# EAGLE design cm_ltc6102 (EAGLE 8.3.0)

## Sheet 1 of 2
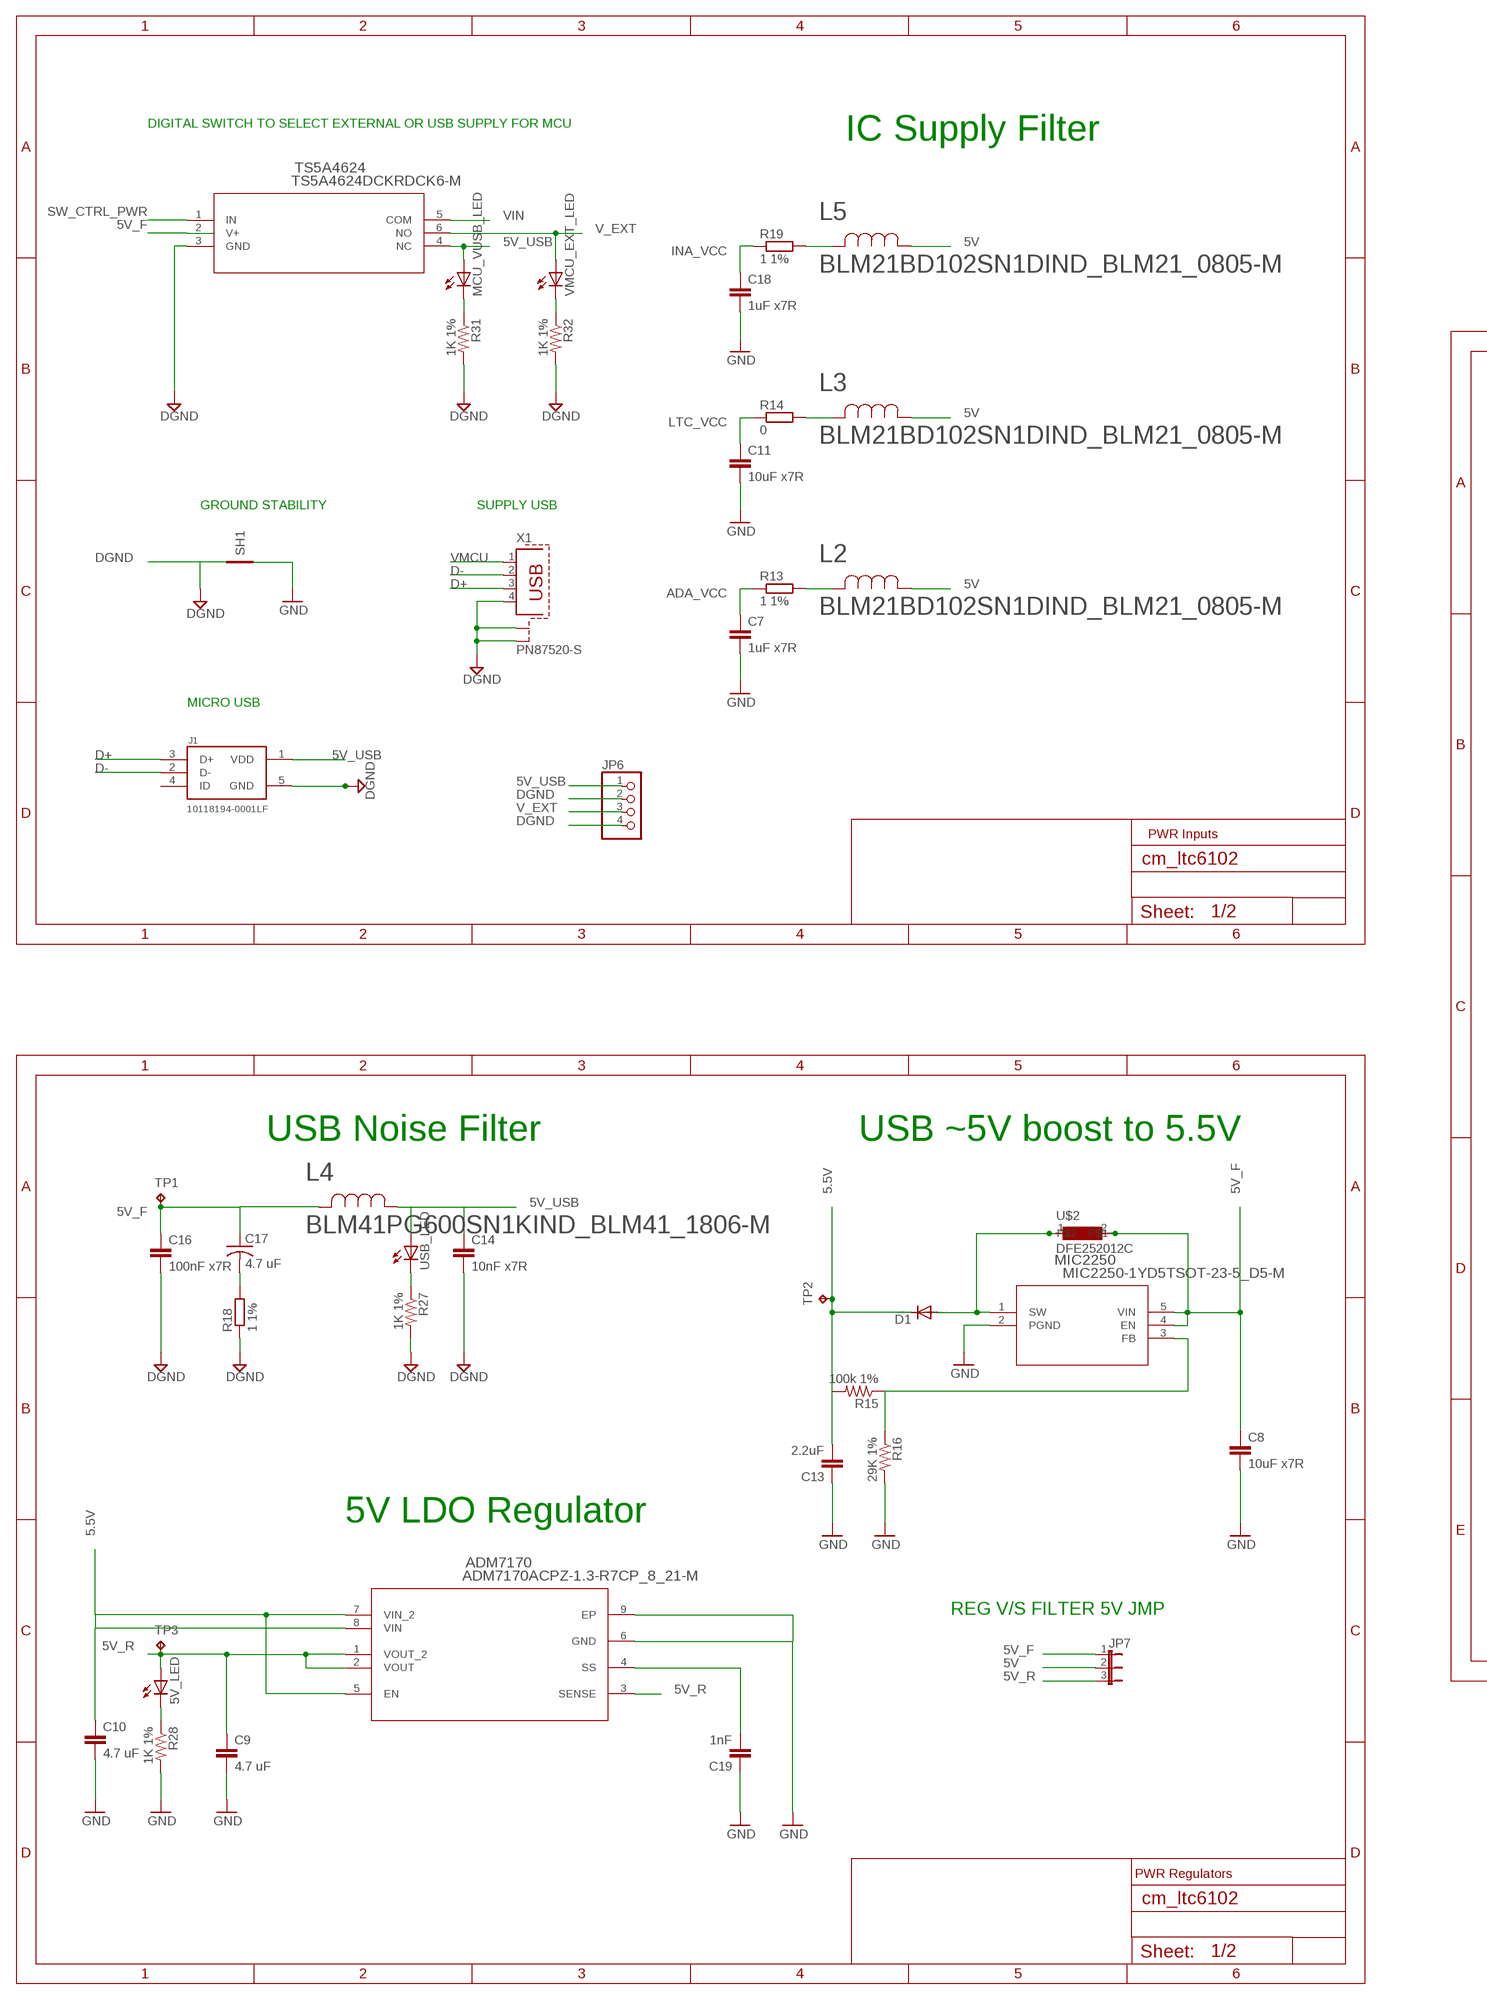
[diagram p0: schematic, sheet 1, part 1 of 2]
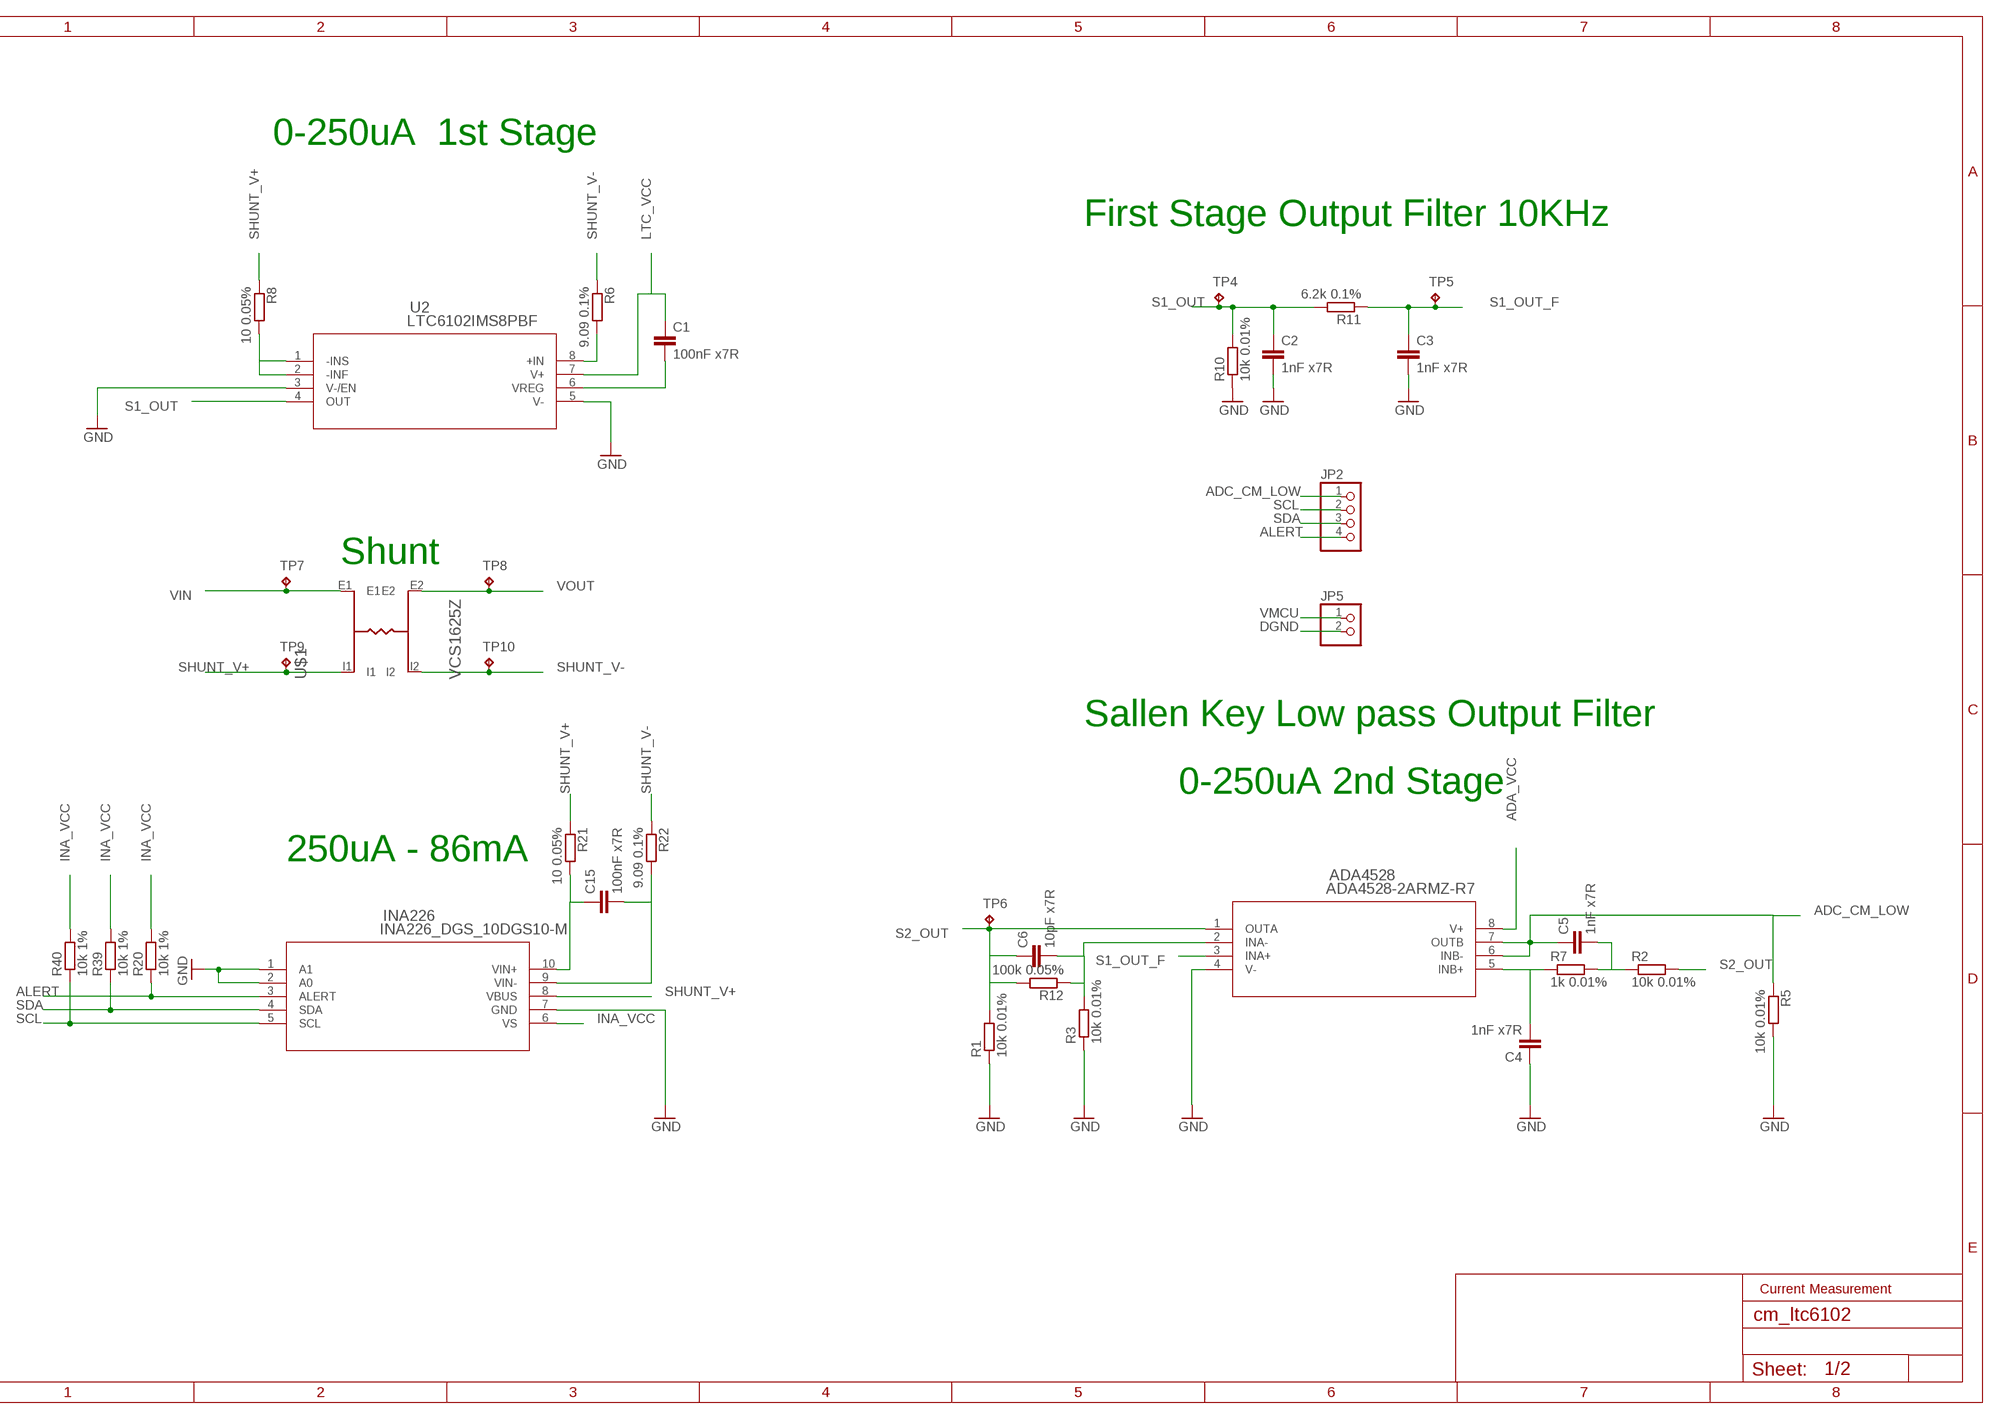
[diagram p1: schematic, sheet 1, part 2 of 2]

### Parts
5V_LED  LEDCHIPLED_0603  [CHIPLED_0603]
ADA4528  ADA4528-2ARMZ-R7  [RM_8]
ADM7170  ADM7170ACPZ-1.3-R7CP_8_21-M  [CP_8_21-M]
C1  100nF x7R  C-EUC0603  [C0603]
C2  1nF x7R  C-EUC0603  [C0603]
C3  1nF x7R  C-EUC0603  [C0603]
C4  1nF x7R  C-EUC0603  [C0603]
C5  1nF x7R  C-EUC0603  [C0603]
C6  10pF x7R  C-EUC0603  [C0603]
C7  1uF x7R  C-EUC0603  [C0603]
C8  10uF x7R  C-EUC0805  [C0805]
C9  4.7 uF  C-EUC1206  [C1206]
C10  4.7 uF  C-EUC1206  [C1206]
C11  10uF x7R  C-EUC0805  [C0805]
C13  2.2uF  C-EUC0603  [C0603]
C14  10nF x7R  C-EUC0603  [C0603]
C15  100nF x7R  C-EUC0603  [C0603]
C16  100nF x7R  C-EUC0603  [C0603]
C17  4.7 uF  C-USC1206  [C1206]
C18  1uF x7R  C-EUC0603  [C0603]
C19  1nF  C-EUC0603  [C0603]
D1  DIODE-SOD80C  [SOD80C]
INA226  INA226_DGS_10DGS10-M  [DGS10-M]
J1  10118194-0001LF  [FRAMATOME_10118194-0001LF]
JP2  PINHD-1X4  [1X04]
JP5  PINHD-1X2  [1X02]
JP6  PINHD-1X4  [1X04]
JP7  JP2E  [JP2]
L2  BLM21BD102SN1DIND_BLM21_0805-M  [IND_BLM21_0805-M]
L3  BLM21BD102SN1DIND_BLM21_0805-M  [IND_BLM21_0805-M]
L4  BLM41PG600SN1KIND_BLM41_1806-M  [IND_BLM41_1806-M]
L5  BLM21BD102SN1DIND_BLM21_0805-M  [IND_BLM21_0805-M]
MCU_VUSB_LED  LEDCHIPLED_0603  [CHIPLED_0603]
MIC2250  MIC2250-1YD5TSOT-23-5_D5-M  [TSOT-23-5_D5-M]
R1  10k 0.01%  R-EU_R0603  [R0603]
R2  10k 0.01%  R-EU_R0603  [R0603]
R3  10k 0.01%  R-EU_R0603  [R0603]
R5  10k 0.01%  R-EU_R0603  [R0603]
R6  9.09 0.1%  R-EU_R0603  [R0603]
R7  1k 0.01%  R-EU_R0805  [R0805]
R8  10 0.05%  R-EU_R0603  [R0603]
R10  10k 0.01%  R-EU_R0603  [R0603]
R11  6.2k 0.1%  R-EU_R0603  [R0603]
R12  100k 0.05%  R-EU_R0603  [R0603]
R13  1 1%  R-EU_R0603  [R0603]
R14  0  R-EU_R0603  [R0603]
R15  100k 1%  R-US_R0603  [R0603]
R16  29K 1%  R-US_R0603  [R0603]
R18  1 1%  R-EU_R0603  [R0603]
R19  1 1%  R-EU_R0603  [R0603]
R20  10k 1%  R-EU_R0603  [R0603]
R21  10 0.05%  R-EU_R0603  [R0603]
R22  9.09 0.1%  R-EU_R0603  [R0603]
R27  1K 1%  R-US_R0603  [R0603]
R28  1K 1%  R-US_R0603  [R0603]
R31  1K 1%  R-US_R0603  [R0603]
R32  1K 1%  R-US_R0603  [R0603]
R39  10k 1%  R-EU_R0603  [R0603]
R40  10k 1%  R-EU_R0603  [R0603]
SH1  SHORT-VT5  [SHORT_TOP-50]
TP1  TPPAD1-20  [P1-20]
TP2  TPPAD1-20  [P1-20]
TP3  TPPAD1-20  [P1-20]
TP4  TPPAD1-20  [P1-20]
TP5  TPPAD1-20  [P1-20]
TP6  TPPAD1-20  [P1-20]
TP7  TPPAD1-20  [P1-20]
TP8  TPPAD1-20  [P1-20]
TP9  TPPAD1-20  [P1-20]
TP10  TPPAD1-20  [P1-20]
TS5A4624  TS5A4624DCKRDCK6-M  [DCK6-M]
U2  LTC6102IMS8PBF  [MSOP-8_MS]
U$1  VCS1625Z  [VCS1625Z]
U$2  DFE252012C  [DFE252012C]
USB_LED  LEDCHIPLED_0603  [CHIPLED_0603]
VMCU_EXT_LED  LEDCHIPLED_0603  [CHIPLED_0603]
X1  PN87520-S  [PN87520-S]

### Nets
5.5V: ADM7170.5(EN) ADM7170.7(VIN_2) ADM7170.8(VIN) C10.1 C13.2 D1.C R15.2 TP2.TP
5V: JP7.2 L2.1 L3.1 L5.1
5V_F: C8.1 C16.1 C17.1 JP7.1 L4.2 MIC2250.4(EN) MIC2250.5(VIN) TP1.TP TS5A4624.2(V+) U$2.2 ; also sheet 2
5V_R: 5V_LED.A ADM7170.1(VOUT_2) ADM7170.2(VOUT) ADM7170.3(SENSE) C9.1 JP7.3 TP3.TP
5V_USB: C14.1 J1.1(VDD) JP6.1 L4.1 MCU_VUSB_LED.A TS5A4624.4(NC) USB_LED.A
ADA_VCC: ADA4528.8(V+) C7.1 R13.1
ADC_CM_LOW: ADA4528.6(INB-) ADA4528.7(OUTB) C5.1 JP2.1 R5.1
ALERT: INA226.3(ALERT) JP2.4 R20.1
D+: J1.3(D+) X1.3
D-: J1.2(D-) X1.2
DGND: C14.2 C16.2 J1.5(GND) JP5.2 JP6.2 JP6.4 R18.1 R27.2 R31.2 R32.2 SH1.2 TS5A4624.3(GND) X1.4 X1.S1 X1.S2 ; also sheet 2
GND: ADA4528.4(V-) ADM7170.6(GND) ADM7170.9(EP) C2.2 C3.2 C4.1 C7.2 C8.2 C9.2 C10.2 C11.2 C13.1 C18.2 C19.1 INA226.1(A1) INA226.2(A0) INA226.7(GND) MIC2250.2(PGND) R1.1 R3.1 R5.2 R10.1 R16.2 R28.2 SH1.1 U2.3(V-/EN) U2.5(V-)
INA_VCC: C18.1 INA226.6(VS) R19.1 R20.2 R39.2 R40.2
LTC_VCC: C1.1 C11.1 R14.1 U2.7(V+)
N$1: R8.2 U2.1(-INS) U2.2(-INF)
N$2: R6.2 U2.8(+IN)
N$3: R27.1 USB_LED.C
N$6: C1.2 U2.6(VREG)
N$7: ADA4528.5(INB+) C4.2 R7.1
N$8: C5.2 R2.1 R7.2
N$9: L3.2 R14.2
N$10: D1.A MIC2250.1(SW) U$2.1
N$11: ADA4528.2(INA-) C6.2 R3.2 R12.1
N$12: L2.2 R13.2
N$13: C15.1 INA226.10(VIN+) R21.2
N$14: ADM7170.4(SS) C19.2
N$17: MIC2250.3(FB) R15.1 R16.1
N$19: C17.2 R18.2
N$20: L5.2 R19.2
N$21: C15.2 INA226.9(VIN-) R22.2
N$22: 5V_LED.C R28.1
N$25: MCU_VUSB_LED.C R31.1
N$26: R32.1 VMCU_EXT_LED.C
S1_OUT: C2.1 R10.2 R11.2 TP4.TP U2.4(OUT)
S1_OUT_F: ADA4528.3(INA+) C3.1 R11.1 TP5.TP
S2_OUT: ADA4528.1(OUTA) C6.1 R1.2 R2.2 R12.2 TP6.TP
SCL: INA226.5(SCL) JP2.2 R40.1
SDA: INA226.4(SDA) JP2.3 R39.1
SHUNT_V+: INA226.8(VBUS) R8.1 R21.1 TP9.TP U$1.I1
SHUNT_V-: R6.1 R22.1 TP10.TP U$1.I2
SW_CTRL_PWR: TS5A4624.1(IN) ; also sheet 2
V_EXT: JP6.3 TS5A4624.6(NO) VMCU_EXT_LED.A
VIN: TP7.TP TS5A4624.5(COM) U$1.E1
VMCU: JP5.1 X1.1 ; also sheet 2
VOUT: TP8.TP U$1.E2 ; also sheet 2
Unconnected: J1.4(ID)

### Notes on the sheet
- DIGITAL SWITCH TO SELECT EXTERNAL OR USB SUPPLY FOR MCU
- IC Supply Filter
- 0-250uA  1st Stage
- GROUND STABILITY | SUPPLY USB
- First Stage Output Filter 10KHz
- MICRO USB
- PWR Inputs
- Shunt
- Sallen Key Low pass Output Filter
- 0-250uA 2nd Stage
- USB Noise Filter | USB ~5V boost to 5.5V
- 250uA - 86mA
- 5V LDO Regulator
- Current Measurement
- REG V/S FILTER 5V JMP
- PWR Regulators

## Sheet 2 of 2
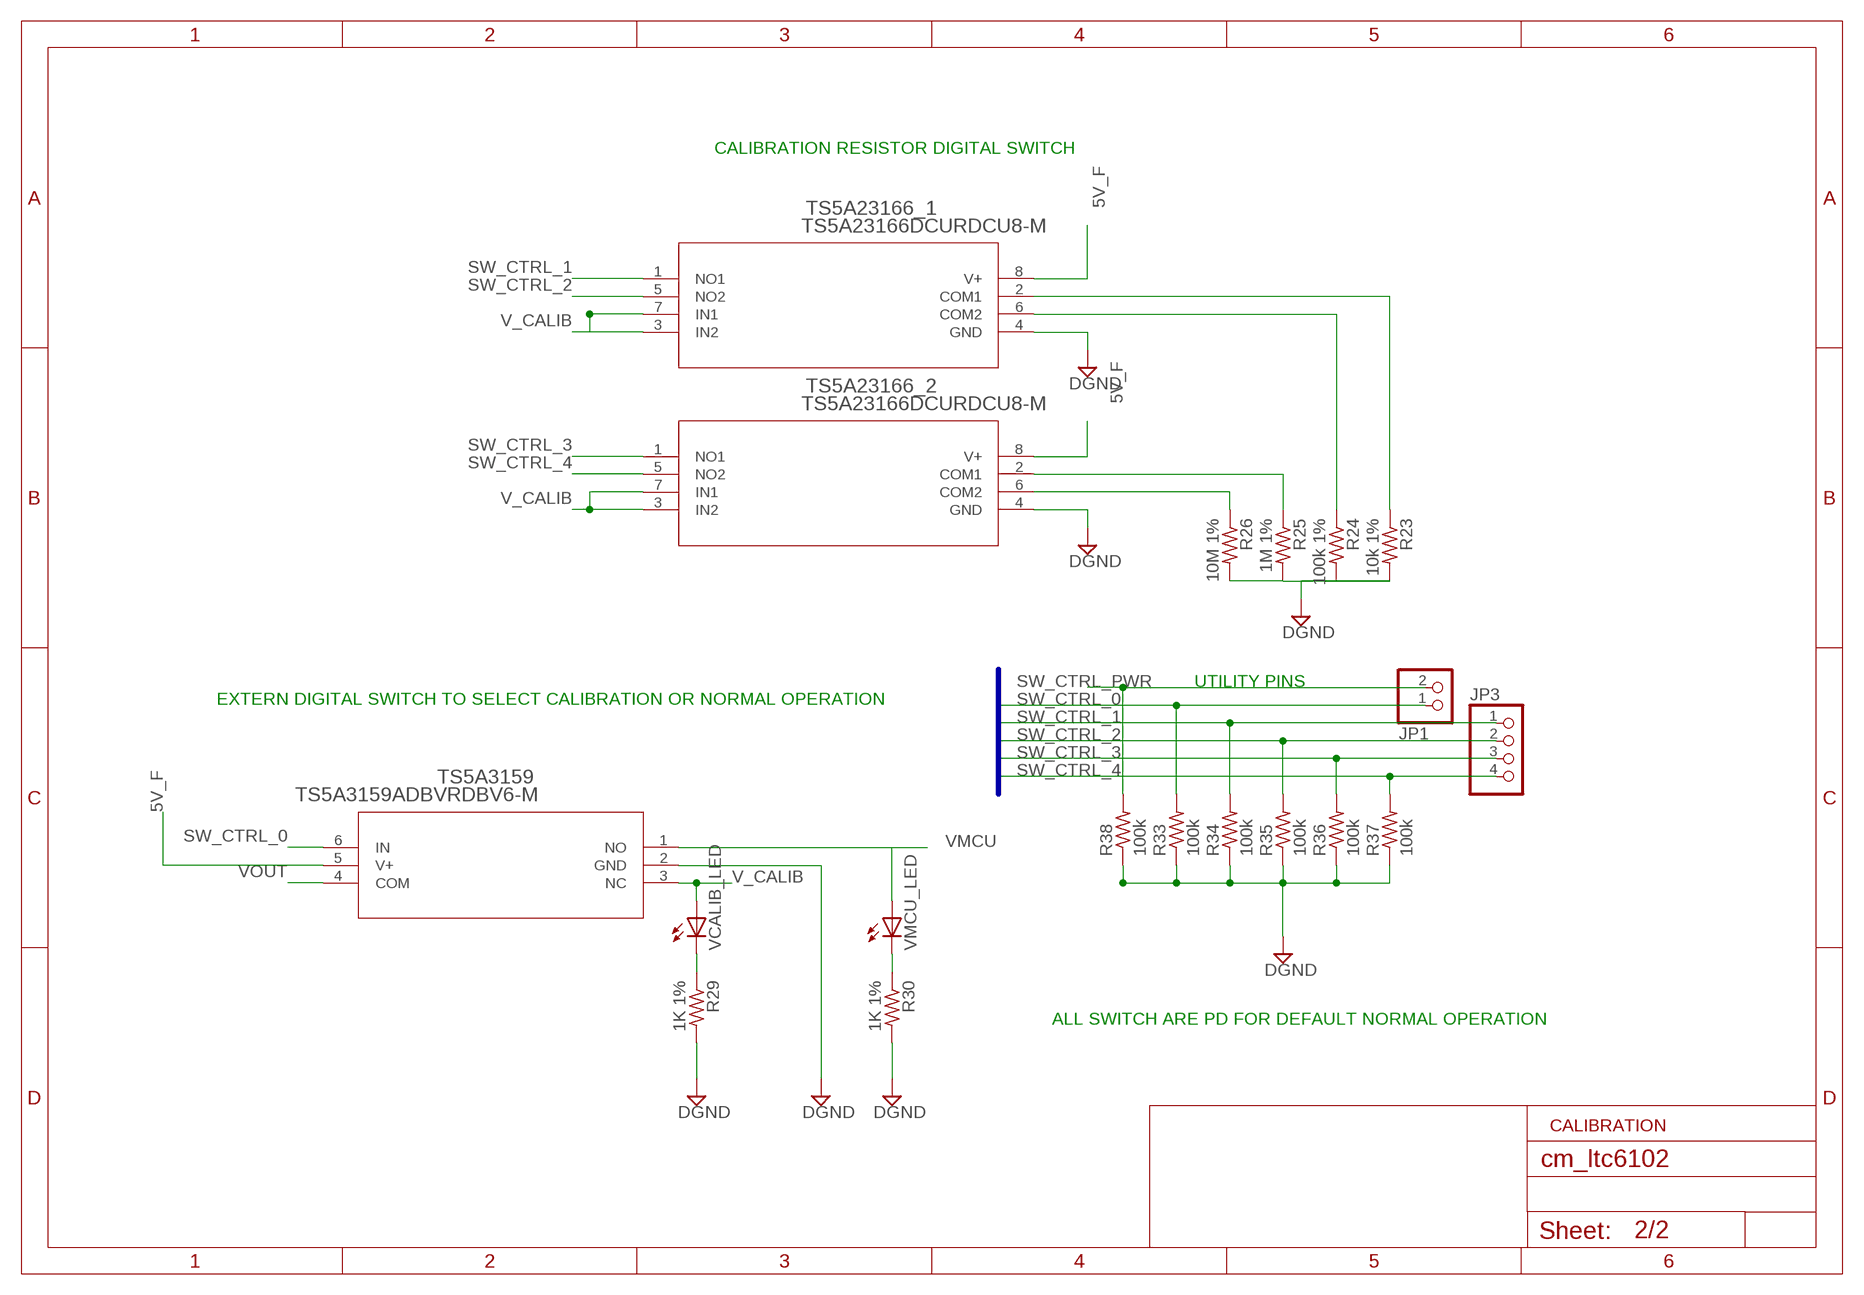
[diagram p2: schematic, sheet 2]

### Parts
JP1  PINHD-1X2  [1X02]
JP3  PINHD-1X4  [1X04]
R23  10k 1%  R-US_R0603  [R0603]
R24  100k 1%  R-US_R0603  [R0603]
R25  1M 1%  R-US_R0603  [R0603]
R26  10M 1%  R-US_R0603  [R0603]
R29  1K 1%  R-US_R0603  [R0603]
R30  1K 1%  R-US_R0603  [R0603]
R33  100k  R-US_R0805  [R0805]
R34  100k  R-US_R0805  [R0805]
R35  100k  R-US_R0805  [R0805]
R36  100k  R-US_R0805  [R0805]
R37  100k  R-US_R0805  [R0805]
R38  100k  R-US_R0805  [R0805]
TS5A3159  TS5A3159ADBVRDBV6-M  [DBV6-M]
TS5A23166_1  TS5A23166DCURDCU8-M  [DCU8-M]
TS5A23166_2  TS5A23166DCURDCU8-M  [DCU8-M]
VCALIB_LED  LEDCHIPLED_0603  [CHIPLED_0603]
VMCU_LED  LEDCHIPLED_0603  [CHIPLED_0603]

### Nets
5V_F: TS5A3159.5(V+) TS5A23166_1.8(V+) TS5A23166_2.8(V+) ; also sheet 1
DGND: R23.2 R24.2 R25.2 R26.2 R29.2 R30.2 R33.1 R34.1 R35.1 R36.1 R37.1 R38.1 TS5A3159.2(GND) TS5A23166_1.4(GND) TS5A23166_2.4(GND) ; also sheet 1
N$23: R29.1 VCALIB_LED.C
N$24: R30.1 VMCU_LED.C
N$30: R23.1 TS5A23166_1.2(COM1)
N$31: R24.1 TS5A23166_1.6(COM2)
N$32: R25.1 TS5A23166_2.2(COM1)
N$33: R26.1 TS5A23166_2.6(COM2)
SW_CTRL_0: JP1.1 R33.2 TS5A3159.6(IN)
SW_CTRL_1: JP3.1 R34.2 TS5A23166_1.1(NO1)
SW_CTRL_2: JP3.2 R35.2 TS5A23166_1.5(NO2)
SW_CTRL_3: JP3.3 R36.2 TS5A23166_2.1(NO1)
SW_CTRL_4: JP3.4 R37.2 TS5A23166_2.5(NO2)
SW_CTRL_PWR: JP1.2 R38.2 ; also sheet 1
V_CALIB: TS5A3159.3(NC) TS5A23166_1.3(IN2) TS5A23166_1.7(IN1) TS5A23166_2.3(IN2) TS5A23166_2.7(IN1) VCALIB_LED.A
VMCU: TS5A3159.1(NO) VMCU_LED.A ; also sheet 1
VOUT: TS5A3159.4(COM) ; also sheet 1

### Buses
SWITCH_CTRL_[1..6]

### Notes on the sheet
- CALIBRATION RESISTOR DIGITAL SWITCH
- UTILITY PINS
- EXTERN DIGITAL SWITCH TO SELECT CALIBRATION OR NORMAL OPERATION
- ALL SWITCH ARE PD FOR DEFAULT NORMAL OPERATION
- CALIBRATION

## Library data of the parts
5V_LED MCU_VUSB_LED USB_LED VCALIB_LED VMCU_EXT_LED VMCU_LED = led:LED: LED OSRAM: - CHIPLED LG R971, LG N971, LY N971, LG Q971, LY Q971, LO R971, LY R971 LH N974, LH R974 LS Q976, LO Q976, LY Q976 LO Q996 - Hyper CHIPLED LW Q18S LB Q993, LB Q99A, LB R99A - SideLED LS A670, LO A670, LY A670, LG A670, LP A670 LB A673, LV A673, LT A673, LW A673 LH A674 LY A675 LS A676, LA A676, LO A676, LY A676, LW A676 LS A679, LY A679, LG A679 - Hyper Micro SIDELED® LS Y876, LA Y876, LO Y876, LY Y876 LT Y87S - SmartLED LW L88C, LW L88S LB L89C, LB L89S, LG L890 LS L89K, LO L89K, LY L89K LS L896, LA L896, LO L896, LY L896 - TOPLED LS T670, LO T670, LY T670, LG T670, LP T670 LSG T670, LSP T670, LSY T670, LOP T670, LYG T670 LG T671, LOG T671, LSG T671 LB T673, LV T673, LT T673, LW T673 LH T674 LS T676, LA T676, LO T676, LY T676, LB T676, LH T676, LSB T676, LW T676 LB T67C, LV T67C, LT T67C, LS T67K, LO T67K, LY T67K, LW E67C LS E67B, LA E67B, LO E67B, LY E67B, LB E67C, LV E67C, LT E67C LW T67C LS T679, LY T679, LG T679 LS T770, LO T770, LY T770, LG T770, LP T770 LB T773, LV T773, LT T773, LW T773 LH T774 LS E675, LA E675, LY E675, LS T675 LS T776, LA T776, LO T776, LY T776, LB T776 LHGB T686 LT T68C, LB T68C - Hyper Mini TOPLED® LB M676 - Mini TOPLED Santana® LG M470 LS M47K, LO M47K, LY M47K Source: http://www.osram.convergy.de LUXEON: - LUMILED® LXK2-PW12-R00, LXK2-PW12-S00, LXK2-PW14-U00, LXK2-PW14-V00 LXK2-PM12-R00, LXK2-PM12-S00, LXK2-PM14-U00 LXK2-PE12-Q00, LXK2-PE12-R00, LXK2-PE12-S00, LXK2-PE14-T00, LXK2-PE14-U00 LXK2-PB12-K00, LXK2-PB12-L00, LXK2-PB12-M00, LXK2-PB14-N00, LXK2-PB14-P00, LXK2-PB14-Q00 LXK2-PR12-L00, LXK2-PR12-M00, LXK2-PR14-Q00, LXK2-PR14-R00 LXK2-PD12-Q00, LXK2-PD12-R00, LXK2-PD12-S00 LXK2-PH12-R00, LXK2-PH12-S00 LXK2-PL12-P00, LXK2-PL12-Q00, LXK2-PL12-R00 Source: www.luxeon.com KINGBRIGHT: KA-3528ASYC Source: www.kingbright.com
ADA4528 = analog_devices:ADA4528-2ARMZ-R7; MANUFACTURER_PART_NUMBER: ADA45282ARMZR7; VENDOR: Analog Devices Inc
ADM7170 = analog_devices:ADM7170ACPZ-1.3-R7; MANUFACTURER_PART_NUMBER: ADM7170ACPZ1.3R7; VENDOR: Analog Devices Inc
C1-C11 C13-C16 C18 C19 = rcl:C-EU: CAPACITOR, European symbol
C17 = rcl:C-US: CAPACITOR, American symbol
D1 = diode:DIODE-: DIODE
INA226 = texas_instruments:INA226_DGS_10; MANUFACTURER_PART_NUMBER: INA226_DGS_10; VENDOR: Texas Instruments
J1 = 10118194-0001LF:10118194-0001LF: Conn Micro USB Type B RCP 5 POS 0.65mm Solder RA SMD 5 Terminal 1 Port T/R; AVAILABILITY: Good; DESCRIPTION: Conn Micro USB Type B RCP 5 POS 0.65mm Solder RA SMD 5 Terminal 1 Port T/R; MF: Amphenol; MP: 10118194-0001LF; PACKAGE: DIP-4 FCI; PRICE: 0.24 USD
JP1 JP5 = pinhead:PINHD-1X2: PIN HEADER
JP2 JP3 JP6 = pinhead:PINHD-1X4: PIN HEADER
JP7 = jumper:JP2E: JUMPER
L2 L3 L5 = ferrite_bead:BLM21BD102SN1D; MANUFACTURER_PART_NUMBER: BLM21BD102SN1D; VENDOR: MURATA
L4 = ferrite_bead:BLM41PG600SN1K; MANUFACTURER_PART_NUMBER: BLM41PG600SN1K; VENDOR: MURATA
MIC2250 = texas_instruments:MIC2250-1YD5; MANUFACTURER_PART_NUMBER: MIC22501YD5; VENDOR: Micrel
R1-R3 R5-R8 R10-R14 R18-R22 R39 R40 = resistor:R-EU_: RESISTOR, European symbol
R15 R16 R23-R32 = rcl:R-US_: RESISTOR, American symbol
R33-R38 = resistor:R-US_: RESISTOR, American symbol
SH1 = shorts-old:SHORT-V: Short between two nets; BOM: no
TP1-TP10 = testpad:TP: Test pad
TS5A3159 = texas_instruments:TS5A3159ADBVR; MANUFACTURER_PART_NUMBER: TS5A3159ADBVR; VENDOR: Texas Instruments
TS5A4624 = texas_instruments:TS5A4624DCKR; MANUFACTURER_PART_NUMBER: TS5A4624DCKR; VENDOR: Texas Instruments
TS5A23166_1 TS5A23166_2 = texas_instruments:TS5A23166DCUR; MANUFACTURER_PART_NUMBER: TS5A23166DCUR; VENDOR: Texas Instruments
U2 = linear_technology:LTC6102IMS8PBF; MANUFACTURER_PART_NUMBER: LTC6102IMS8#PBF; VENDOR: Linear Technology
U$1 = vishay:VCS1625Z
U$2 = DFE252012C:DFE252012C
X1 = con-berg:PN87520-S; OC_FARNELL: unknown; OC_NEWARK: unknown

## Board
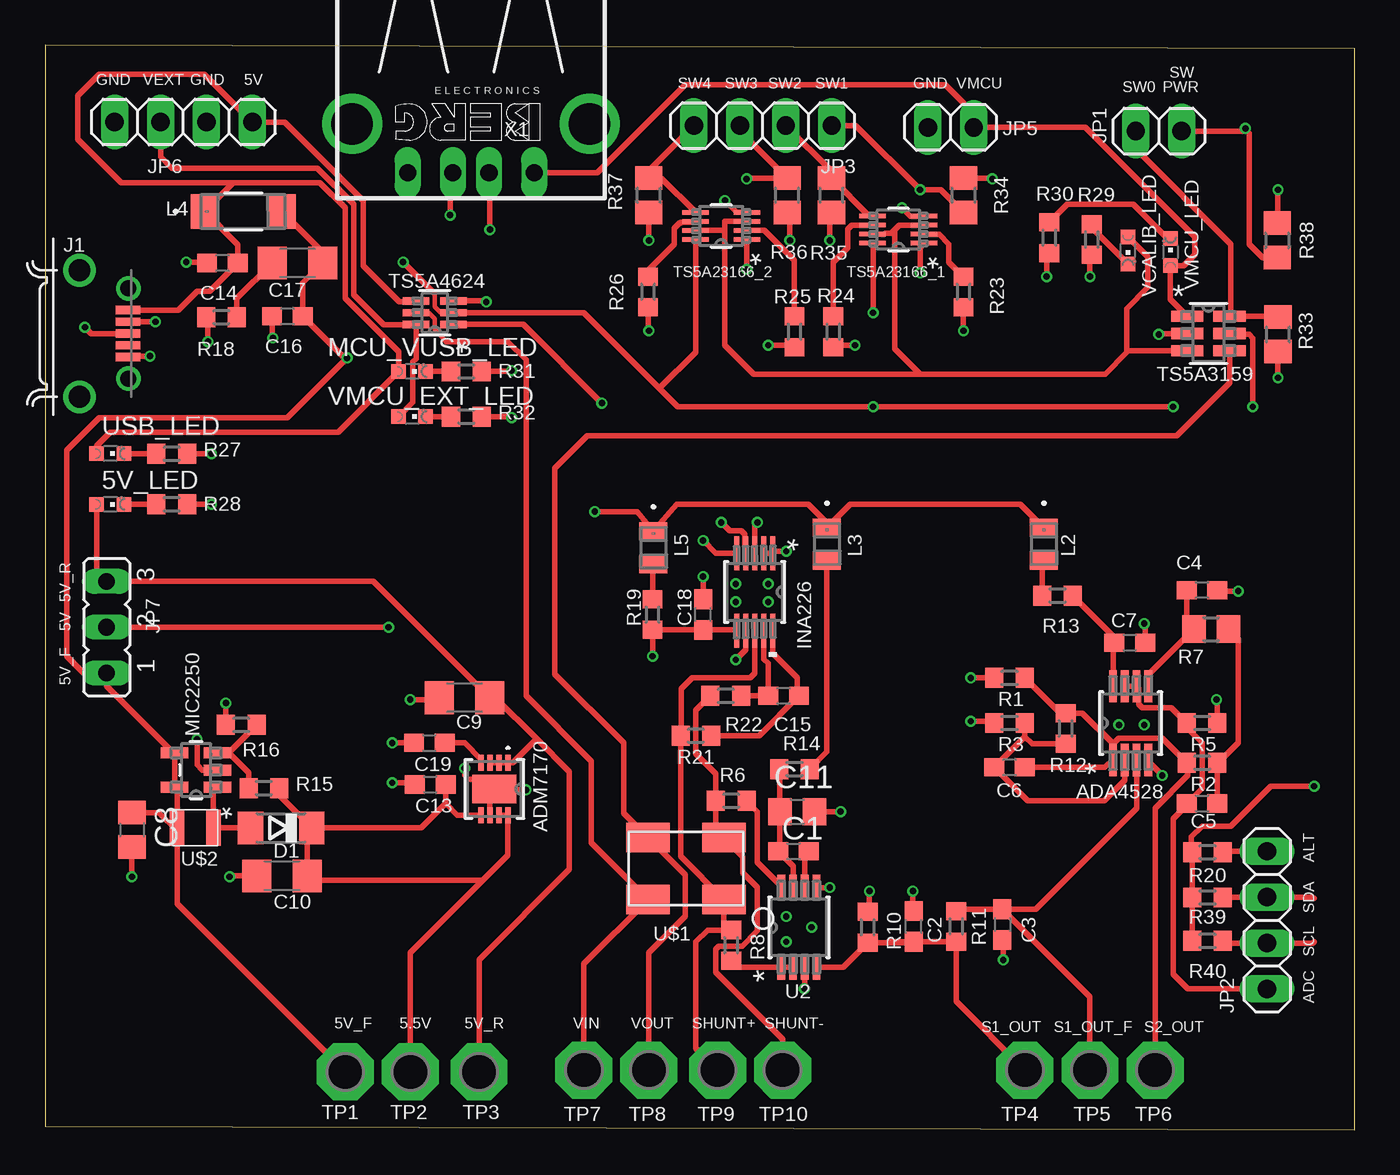
[diagram p3: board, top side]
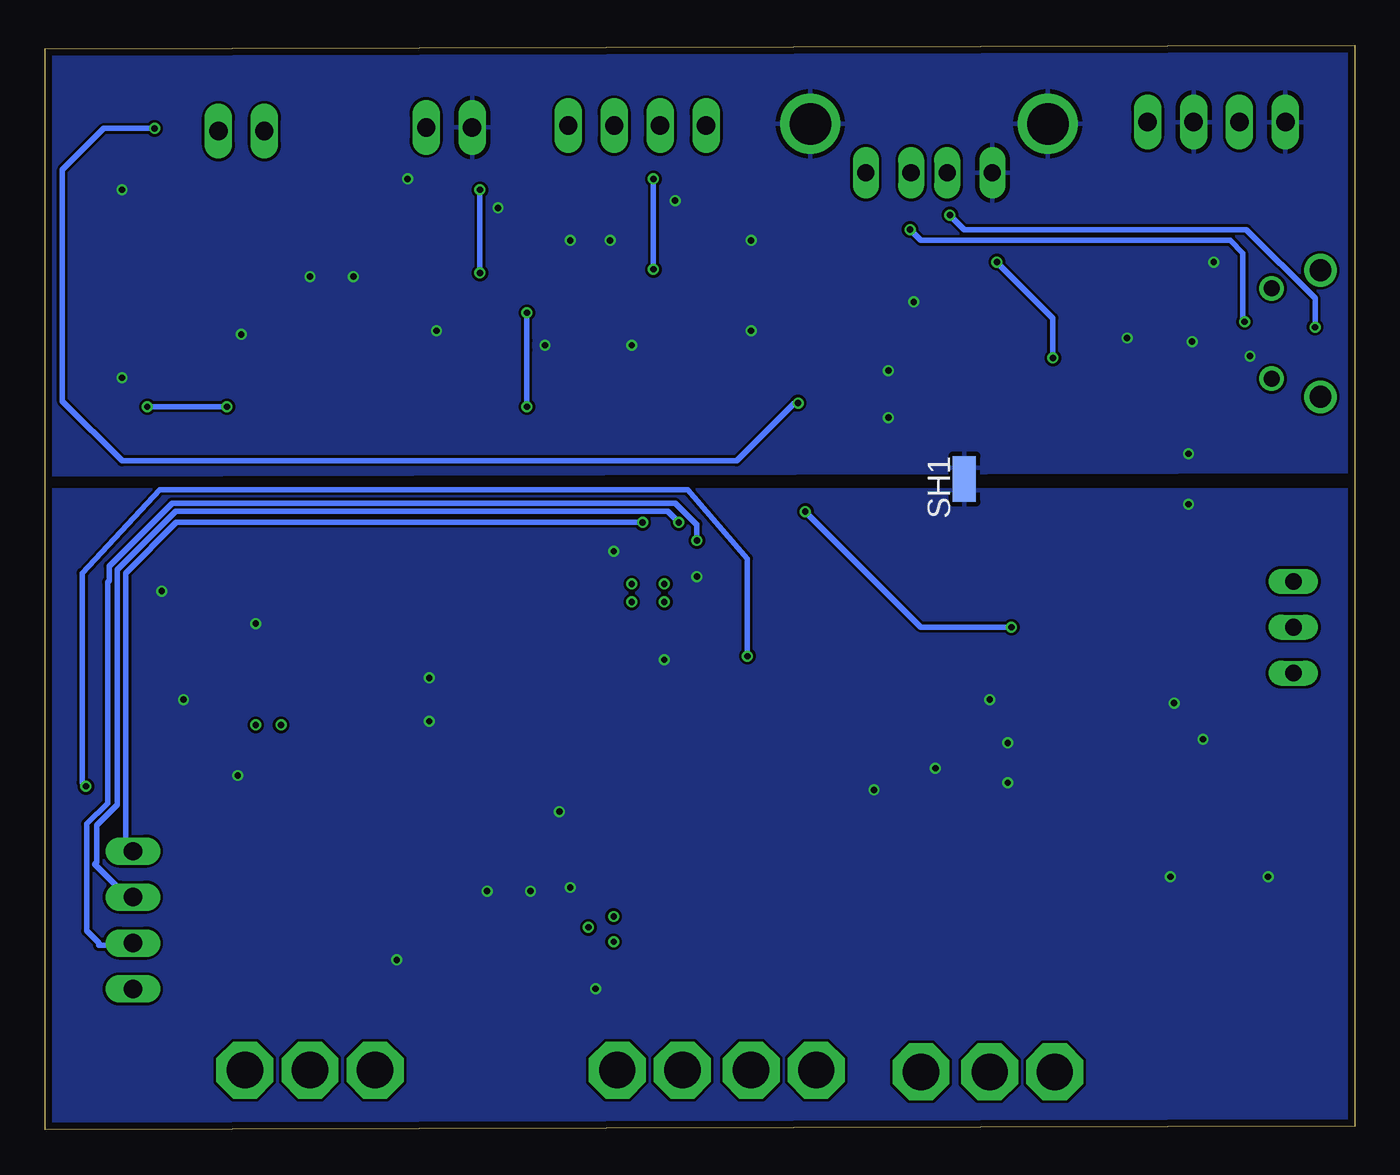
[diagram p4: board, bottom side, seen from below]

Size 72.45 x 60 mm. Coordinates in mm from the lower left corner, seen from the top.
Outline: 0,0.2 72.45,0 72.45,59.8 0,60 0,0.2
Copper layers (1*16): Top 0.035559375mm / dielectric 1.6mm / Bottom 0.035559375mm
Design rules "oshpark-2layer (1) *": minimum track width 6mil, minimum drill 10mil, track to track 6mil, track to pad 6mil, pad to pad 6mil, via to via 6mil, smd to smd 6mil, copper to edge 15mil, drill to drill 6mil, minimum pad ring 5mil, minimum via ring 5mil, stop-mask expansion 2.5mil, vias tented up to drill 0mil, thermal gap 10mil

### Footprints (pad centres in the part's own frame; a part is rotated, then mirrored left to right if it is on the bottom)
CHIPLED_0603 = smd 0.8 x 0.8: A 0,-0.75; C 0,0.75
RM_8 = smd 1.778 x 0.432: 1 -2.045,0.975; 2 -2.045,0.325; 3 -2.045,-0.325; 4 -2.045,-0.975; 5 2.045,-0.975; 6 2.045,-0.325; 7 2.045,0.325; 8 2.045,0.975
CP_8_21-M = smd 0.906 x 0.3: 1 -1.453,0.75; 2 -1.453,0.25; 3 -1.453,-0.25; 4 -1.453,-0.75; 5 1.453,-0.75; 6 1.453,-0.25; 7 1.453,0.25; 8 1.453,0.75 | smd 1.6 x 2.44: 9 0,0
C0603 = smd 1.1 x 1: 1 -0.85,0; 2 0.85,0
C0805 = smd 1.3 x 1.5: 1 -0.95,0; 2 0.95,0
C1206 = smd 1.6 x 1.8: 1 -1.4,0; 2 1.4,0
SOD80C = smd 1.4 x 1.8: A 1.7,0; C -1.7,0
DGS10-M = smd 1.88 x 0.279: 1 -2.146,1; 2 -2.146,0.5; 3 -2.146,0; 4 -2.146,-0.5; 5 -2.146,-1; 6 2.146,-1; 7 2.146,-0.5; 8 2.146,0; 9 2.146,0.5; 10 2.146,1
FRAMATOME_10118194-0001LF = smd 0.45 x 1.35: 1 -1.3,2.675; 2 -0.65,2.675; 3 0,2.675; 4 0.65,2.675; 5 1.3,2.675 | drill 0.9: P$6 -2.5,2.7; P$7 2.5,2.7 | drill 1.2: P$8 -3.5,0; P$9 3.5,0
1X02 = drill 1.016 long: 1 -1.27,0; 2 1.27,0
1X04 = drill 1.016 long: 1 -3.81,0; 2 -1.27,0; 3 1.27,0; 4 3.81,0
JP2 = drill 0.914 long: 1 -2.54,0; 2 0,0; 3 2.54,0
IND_BLM21_0805-M = smd 1.016 x 1.549: 1 -0.902,0; 2 0.902,0
IND_BLM41_1806-M = smd 1.549 x 1.905: 1 -2.134,0; 2 2.134,0
TSOT-23-5_D5-M = smd 1.524 x 0.61: 1 -1.194,0.95; 2 -1.194,0; 3 -1.194,-0.95; 4 1.194,-0.95; 5 1.194,0.95
R0603 = smd 1 x 1.1: 1 -0.85,0; 2 0.85,0
R0805 = smd 1.3 x 1.5: 1 -0.95,0; 2 0.95,0
SHORT_TOP-50 = smd 1.27 x 1.27: 1 0.635,0; 2 -0.635,0
P1-20 = drill 2.007 pad 3.15 octagon: TP 0,0
DBV6-M = smd 1.778 x 0.61: 1 -1.168,0.95; 2 -1.168,0; 3 -1.168,-0.95; 4 1.168,-0.95; 5 1.168,0; 6 1.168,0.95
DCK6-M = smd 1.473 x 0.406: 1 -1.029,0.65; 2 -1.029,0; 3 -1.029,-0.65; 4 1.029,-0.65; 5 1.029,0; 6 1.029,0.65
DCU8-M = smd 1.473 x 0.254: 1 -1.422,0.75; 2 -1.422,0.25; 3 -1.422,-0.25; 4 -1.422,-0.75; 5 1.422,-0.75; 6 1.422,-0.25; 7 1.422,0.25; 8 1.422,0.75
MSOP-8_MS = smd 1.397 x 0.432: 1 -2.21,0.975; 2 -2.21,0.325; 3 -2.21,-0.325; 4 -2.21,-0.975; 5 2.21,-0.975; 6 2.21,-0.325; 7 2.21,0.325; 8 2.21,0.975
VCS1625Z = smd 2.41 x 1.65: E1 2.095,1.715; E2 2.095,-1.715; I1 -2.095,1.715; I2 -2.095,-1.715
DFE252012C = smd 0.8 x 2: 1 -1,0; 2 1,0
PN87520-S = drill 0.95 long: 1 -3.5,2.71; 2 -1,2.71; 3 1,2.71; 4 3.5,2.71 | drill 2.3 pad 2.9: S1 -6.57,0; S2 6.57,0

### Placement (x,y rotation side)
5V_LED  3.6,34.6 270 top
ADA4528  60.05,22.5 90 top
ADM7170  24.85,18.85 270 top
C1  41.4,15.4 0 top
C2  48.05,11.25 90 top
C3  52.95,11.35 270 top
C4  64,29.85 180 top
C5  64,18.05 0 top
C6  53.35,20.05 180 top
C7  60,26.95 0 top
C8  4.8,16.6 270 top
C9  23.2,23.9 180 top
C10  13.1,14.05 180 top
C11  41.6,17.6 0 top
C13  21.3,19.1 0 top
C14  9.8,47.95 180 top
C15  40.85,24 180 top
C16  13.4,45 180 top
C17  13.95,47.95 180 top
C18  36.4,28.5 90 top
C19  21.25,21.4 0 top
D1  13.05,16.7 180 top
INA226  39.25,29.75 270 top
J1  1.9,44.05 270 top
JP1  61.6,55.25 0 top
JP2  67.6,11.6 90 top
JP3  39.7,55.55 180 top
JP5  50.1,55.45 180 top
JP6  7.65,55.75 180 top
JP7  3.4,27.8 90 top
L2  55.25,32.4 270 top
L3  43.25,32.4 270 top
L4  10.95,50.8 0 top
L5  33.65,32.2 270 top
MCU_VUSB_LED  20.3,41.95 270 top
MIC2250  8.35,19.9 180 top
R1  53.35,25 0 top
R2  64,20.3 180 top
R3  53.35,22.5 0 top
R5  64,22.5 0 top
R6  37.95,18.2 0 top
R7  64.5,27.7 0 top
R8  37.95,10.2 270 top
R10  45.5,11.2 270 top
R11  50.4,11.25 270 top
R12  56.45,22.2 90 top
R13  56,29.55 180 top
R14  41.45,19.95 0 top
R15  12.1,18.9 0 top
R16  10.85,22.4 180 top
R18  9.75,44.95 0 top
R19  33.6,28.5 90 top
R20  64.3,15.35 180 top
R21  36,21.8 0 top
R22  37.65,24 0 top
R23  50.8,46.35 270 top
R24  43.6,44.15 270 top
R25  41.45,44.15 270 top
R26  33.35,46.35 270 top
R27  7,37.4 0 top
R28  7,34.6 0 top
R29  57.9,49.25 270 top
R30  55.55,49.35 270 top
R31  23.3,41.95 0 top
R32  23.3,39.45 0 top
R33  68.2,44 90 top
R34  50.8,51.7 270 top
R35  43.5,51.7 90 top
R36  41.05,51.7 90 top
R37  33.4,51.7 90 top
R38  68.15,49.2 270 top
R39  64.3,12.85 180 top
R40  64.3,10.45 180 top
SH1  21.6,36 270 bottom
TP1  16.6,3.2 0 top
TP2  20.2,3.2 0 top
TP3  24,3.2 0 top
TP4  54.2,3.3 0 top
TP5  57.8,3.3 0 top
TP6  61.4,3.3 0 top
TP7  29.8,3.3 0 top
TP8  33.4,3.3 0 top
TP9  37.2,3.3 0 top
TP10  40.8,3.3 0 top
TS5A3159  64.35,44.05 0 top
TS5A4624  21.55,45.2 180 top
TS5A23166_1  47.2,49.8 180 top
TS5A23166_2  37.4,50 180 top
U2  41.7,11.2 90 top
U$1  35.45,14.45 180 top
U$2  8.3,16.7 180 top
USB_LED  3.6,37.4 270 top
VCALIB_LED  59.9,48.65 180 top
VMCU_EXT_LED  20.3,39.45 270 top
VMCU_LED  62.25,48.55 0 top
X1  23.55,55.65 180 top

### Tracks (layer width: path | path; a pad name or v marks a point on that pad's centre or on a via)
5.5V
  Top 0.2: 14.5,16.45 14.61,16.56 D1.C 14.75,17.1
  Top 0.305: 22.15,18.05 C13.2 | 22.15,18.05 22.8,17.4 ADM7170.5 | ADM7170.7 ADM7170.8 25.6,15.2 24.2,13.8 | 24.2,13.8 14.75,13.8 C10.1 14.5,16.45 14.61,16.56 | TP2.TP 20.2,9.8 24.2,13.8 | 22.15,18.05 20.8,16.7 D1.C 12.95,18.5 R15.2
5V  (via drill 0.35)
  Top 0.2: L3.1 43.34,33.39 43.4,33.45
  Top 0.305: v19,27.8 JP7.2 | v30.4,34.2 32.75,34.2 L5.1 34.95,34.6 42.2,34.6 43.34,33.46 43.34,33.39 | L3.1 44.55,34.6 53.95,34.6 L2.1
  Bottom 0.305: v19,27.8 24,27.8 v30.4,34.2
5V_F  (via drill 0.35)
  Top 0.2: C17.1 15.68,48.02
  Top 0.254: TS5A4624.2 21.89,45.2 21.56,45.53 21.56,46.24 21.49,46.31
  Top 0.305: 21.49,46.31 v19.8,48 | 7.3,16.55 U$2.2 7.3,18.81 MIC2250.5 7.16,20.77 | 7.3,16.55 7.3,12.5 TP1.TP | C8.1 6.3,17.55 7.3,16.55 | 7.16,20.77 MIC2250.4 | 7.16,20.77 3.4,24.53 JP7.1 2.14,25.26 1.2,26.2 1.2,37.6 3,39.4 13.4,39.4 v16.7,42.7 16.55,42.7 C16.1 14.25,46.85 C17.1 15.35,48.53 L4.2 | TS5A4624.2 24.14,45.2 24.15,45.19 29.81,45.19 33.98,41.02 | 33.98,41.02 35,40 v45.8,40 v62.4,40 | v45.8,45.2 45.8,49.03 TS5A23166_1.8 | v66.8,40 66.8,43.8 66.6,44 65.57,44 TS5A3159.5 | TS5A23166_2.8 35.98,43.01 33.98,41.02
  Bottom 0.2: 16.6,42.6 v16.7,42.7
  Bottom 0.305: v45.8,40 45.8,43.14 45.81,43.15 45.81,43.65 45.8,43.66 v45.8,45.2 | v62.4,40 v66.8,40 | v16.7,42.7 16.7,44.9 v19.8,48
5V_R
  Top 0.305: 5V_LED.A 2.85,30.89 JP7.3 18.16,30.34 C9.1 24.9,23.9 27.18,21.62 | 27.18,21.62 29,19.8 29,14.4 24,9.4 TP3.TP | 27.18,21.62 25.87,20.3 ADM7170.1 ADM7170.2 ADM7170.3
5V_USB
  Top 0.254: JP6.1
  Top 0.305: J1.1 7.35,45.35 8.4,46.4 9.1,46.4 C14.1 10.65,48.97 L4.1 10.42,52.4 | USB_LED.A 2.85,37.85 3.6,38.6 16.2,38.6 MCU_VUSB_LED.A 19.55,43.05 16.6,46 16.6,51 15.2,52.4 10.42,52.4 | 10.42,52.4 4.2,52.4 1.8,54.8 1.8,57.2 3,58.4 8.8,58.4 JP6.1 | JP6.1 13.25,55.75 17.6,51.4 17.6,47.8 19.6,45.8 20.47,45.8 TS5A4624.4
ADA_VCC
  Top 0.305: ADA4528.8 59.08,26.88 C7.1 59.15,27.25 R13.1
ADC_CM_LOW
  Top 0.305: JP2.1 63.2,7.8 62.4,8.6 62.4,17.2 63.15,17.95 C5.1 64,18.9 64,21.4 63.15,22.25 R5.1 62.3,23.35 60.68,23.35 60.5,23.53 60.5,24.41 ADA4528.6 ADA4528.7
ALERT  (via drill 0.35)
  Top 0.305: INA226.3 39.25,33.45 v39.4,33.6 | JP2.4 65.21,15.41 R20.1
  Bottom 0.305: v39.4,33.6 39.61,33.6 39.62,33.6 65.2,33.6 68,30.8 68,15.81 JP2.4
D+  (via drill 0.35)
  Top 0.305: J1.3 2.55,44.05 v2.2,44.4 | v22.4,50.6 22.4,52.79 X1.3
  Bottom 0.305: v2.2,44.4 2.2,46 6,49.8 21.6,49.8 v22.4,50.6
D-  (via drill 0.35)
  Top 0.305: v24.6,49.8 24.6,52.89 X1.2 | v6.1,44.7 J1.2
  Bottom 0.254: 6.2,44.8 v6.1,44.7
  Bottom 0.305: v24.6,49.8 24,49.2 6.9,49.2 6.2,48.5 6.2,44.8
DGND  (via drill 0.35)
  Top 0.2: 25.75,39.45 v25.8,39.4 | 25.75,41.95 v25.8,42 | R30.2 55.4,48.35 | 57.8,48.3 R29.2 | R38.1 68.2,50.2 | 24.35,45.85 v24.4,45.8 | 33.35,44.25 v33.4,44.2
  Top 0.305: TS5A4624.3 24.35,45.85 | R26.2 33.35,44.25 | C14.2 8.95,48 v7.8,48 | C16.2 12.55,43.8 v12.6,43.8 | J1.5 4.58,42.8 v5.8,42.8 | R18.1 9,44.95 v9,43.6 | R32.2 25.75,39.45 | R31.2 25.75,41.95 | R27.2 v9.2,37.4 | R36.1 41.2,50.75 v41.2,49.2 | R35.1 43.4,50.75 v43.4,49.2 | TS5A23166_2.4 38.25,50.75 v37.6,51.4 | R25.2 41.45,43.4 v40,43.4 | R24.2 43.6,43.4 v44.8,43.4 | TS5A23166_1.4 47.85,50.55 v47.4,51 | R34.1 52.4,52.65 v52.4,52.6 | R23.2 v50.8,44.2 | 55.4,48.35 v55.4,47.2 | R29.2 57.8,48.4 v57.8,47.2 | TS5A3159.2 61.6,44.05 v61.6,44 | R33.1 v68.2,41.6 | 68.2,50.2 v68.2,52 | R37.1 v33.4,49.2
  pour Bottom: -0.8,61.6 -0.8,36.4 73.2,36.2 73.2,61.4
GND  (via drill 0.35)
  Top 0.2: 61.02,19.97 ADA4528.4
  Top 0.305: ADM7170.6 24.6,18.6 ADM7170.9 | C8.2 v4.8,14 | R16.2 v10,23.6 | MIC2250.2 8.7,19.9 8.4,20.2 v8.4,21.6 | C10.2 10.25,14.05 v10.2,14 | C13.1 20.45,19.2 v19.2,19.2 | C19.1 v19.2,21.4 | C9.2 21.8,23.8 v20.2,23.8 | v26.6,18.8 24.85,18.8 ADM7170.9 | ADM7170.9 24.3,19.4 23.4,19.4 23.2,19.6 v23.2,20 | U2.3 42.02,7.8 v42,7.8 | U2.5 v43.4,13.4 | C11.2 v44,17.6 | INA226.7 38.75,26.55 v38.2,26 | C18.2 v36.4,30.6 | INA226.2 INA226.1 40.25,32 v41,32 | R10.1 45.6,12.15 v45.6,13.2 | C2.2 48,12.15 v48,13.2 | C3.2 53,10.45 v53,9.4 | R5.2 64.85,23.75 v64.8,23.8 | ADA4528.4 61.02,20.38 v61.8,19.6 | R1.1 v51.2,25 | R3.1 52.4,22.6 v51.2,22.6 | C4.1 64.85,29.8 v66,29.8 | C7.2 60.85,28 v60.8,28 | v9.2,34.6 R28.2
  pour Bottom: -0.8,35.4 -0.8,-0.8 73.2,-0.8 73.2,35.4
INA_VCC  (via drill 0.35)
  Top 0.2: INA226.6 38.2,27.65 | 63.45,15.22 R20.2
  Top 0.305: 38.2,27.65 C18.1 R19.1 v33.6,26.2 | v70.2,19 67.8,19 65.6,16.8 64,16.8 63.4,16.2 63.4,15.27 63.45,15.22 | R20.2 R39.2 R40.2
  Bottom 0.305: v33.6,26.2 33.6,31.6 36.9,35.4 66.1,35.4 70.4,30.8 70.4,19.2 v70.2,19
LTC_VCC
  Top 0.2: 41.4,13.43 U2.7 | 40.5,17.45 C11.1 40.55,17.5 | 40.65,19.9 R14.1
  Top 0.305: U2.7 41.38,14.57 C1.1 40.65,15.5 C11.1 40.65,19.9
N$1
  Top 0.305: U2.2 U2.1 38.31,8.99 R8.2
N$2
  Top 0.305: U2.8 40.73,13.47 39.4,14.8 39.4,17.6 R6.2
N$3
  Top 0.305: USB_LED.C R27.1
N$4  (via drill 0.35)
  other vias: 38.2,30.2
N$6
  Top 0.305: U2.6 42.02,15.17 C1.2
N$7
  Top 0.305: ADA4528.5 61.02,25.18 63.52,27.67 | 63.52,27.67 R7.1 | C4.2 63.15,27.67 63.52,27.67
N$8
  Top 0.305: C5.2 R2.1 64.9,20.3 66,21.4 66,27.15 R7.2
N$9
  Top 0.305: L3.2 43.25,20.9 R14.2
N$10
  Top 0.2: 9.3,18.71 9.42,18.83 MIC2250.1
  Top 0.305: 9.42,18.83 9.3,18.71 U$2.1 D1.A
N$11
  Top 0.305: ADA4528.2 59.73,19.32 58.6,18.2 54.35,18.2 C6.2 54.2,21.75 | 54.2,21.75 R3.2 | R12.1 54.6,21.35 54.2,21.75
N$12
  Top 0.2: L2.2 55.15,31.4
  Top 0.305: R13.2 55.15,31.4 L2.2
N$13
  Top 0.305: R21.2 39.5,21.8 C15.1 41.6,24.1 41.6,25 40.25,26.35 INA226.10
N$14
  Top 0.305: C19.2 23.2,21.4 24.1,20.5 ADM7170.4
N$16  (via drill 0.35)
  other vias: 40,30.2
N$17
  Top 0.2: 10.15,20.85 MIC2250.3
  Top 0.305: R15.1 11.25,19.75 10.15,20.85 | MIC2250.3 10.15,20.85 | 10.15,20.85 R16.1
N$19
  Top 0.305: R18.2 10.6,46 C17.2
N$20
  Top 0.305: R19.2 33.6,31.25 L5.2
N$21
  Top 0.305: R22.2 C15.2 40,25.8 39.76,26.04 INA226.9
N$22
  Top 0.305: R28.1 5V_LED.C
N$23
  Top 0.305: R29.1 57.9,49.9 VCALIB_LED.C
N$24
  Top 0.305: VMCU_LED.C 62.1,49.3 60.2,51.2 56.55,51.2 R30.1
N$25
  Top 0.305: R31.1 MCU_VUSB_LED.C
N$26
  Top 0.305: VMCU_EXT_LED.C R32.1
N$27  (via drill 0.35)
  other vias: 38.2,29.2
N$28  (via drill 0.35)
  other vias: 40,29.2
N$29  (via drill 0.35)
  other vias: 42.4,11.2
N$30
  Top 0.305: TS5A23166_1.2 49.45,49.55 50,49 50,48 R23.1
N$31
  Top 0.305: R24.1 43.6,48 44.4,48.8 44.4,49.82 44.63,50.05 TS5A23166_1.6
N$32
  Top 0.305: R25.1 41.45,48.09 39.79,49.75 TS5A23166_2.2
N$33
  Top 0.305: R26.1 33.35,47.55 34.8,49 34.8,49.87 35.12,50.18 35.18,50.18 35.2,50.2 35.82,50.2 35.85,50.23 35.96,50.23 TS5A23166_2.6
N$34  (via drill 0.35)
  other vias: 41,11.8
N$35  (via drill 0.35)
  other vias: 41,10.4
N$36  (via drill 0.35)
  other vias: 60.8,22.4
N$37  (via drill 0.35)
  other vias: 59.4,22.4
S1_OUT
  Top 0.2: C2.1 47.8,10.4
  Top 0.305: U2.4 44.14,8.99 R10.2 46.62,10.35 | 46.62,10.35 48,10.35 C2.1 | TP4.TP 50.4,7.1 R11.2 46.67,10.4 46.62,10.35
S1_OUT_F
  Top 0.2: R11.1 50.5,12.2
  Top 0.305: C3.1 50.5,12.2 | C3.1 57.8,7.35 TP5.TP | ADA4528.3 60.38,17.77 54.8,12.2 C3.1
S2_OUT
  Top 0.2: R2.2 | 54.25,20 C6.1
  Top 0.305: TP6.TP 61.4,17.8 63.2,19.6 63.2,20.25 R2.2 61.8,21.65 59.38,21.65 59.08,21.34 | 59.08,20.5 59.08,21.34 | 59.08,20.5 ADA4528.1 | 59.08,21.34 57.37,23.05 R12.2 56.15,23.05 R1.2 | C6.1 58.63,20.05 59.08,20.5
SCL  (via drill 0.35)
  Top 0.305: INA226.5 37.1,31.9 v36.4,32.6 | R40.1 65.27,10.33 JP2.2 70.13,10.33 70.2,10.4
  Bottom 0.305: v36.4,32.6 36.4,33.5 36.44,33.5 37.61,34.66 65.43,34.66 68.91,31.18 68.91,30.39 69,30.3 69,18.07 70.16,16.92 70.16,11 69.5,10.34 69.5,10.2 67.73,10.2 JP2.2
SDA  (via drill 0.35)
  Top 0.305: INA226.4 38.71,31.94 38.71,32.95 38.52,33.14 37.86,33.14 v37.4,33.6 | R39.1 65.17,12.87 JP2.3 70.13,12.87 70.2,12.8
  Bottom 0.305: JP2.3 67.87,12.87 69.7,14.7 69.59,14.81 69.59,16.83 68.46,17.97 68.46,30.99 65.24,34.21 38.01,34.21 v37.4,33.6
SHUNT_V+
  Top 0.305: TP9.TP 36,4.5 36,10.4 36.65,11.05 R8.1 37.55,11.46 U$1.I1 35.15,15.13 R21.1 35.2,21.85 35.2,24.4 35.8,25 39,25 39.25,25.25 INA226.8
SHUNT_V-
  Top 0.305: TP10.TP 40.8,5.02 37.09,8.72 37.09,9.98 37.27,10.15 38.55,10.15 39.4,11 39.4,13.43 38.6,14.23 38.6,15.11 U$1.I2 37.1,16.61 R6.1 37.1,19.7 36,20.8 36,23.2 R22.1
SW_CTRL_0
  Top 0.305: JP1.1 60.33,54.27 65.6,49 65.6,45.08 TS5A3159.6 68.15,45 R33.2
SW_CTRL_1  (via drill 0.35)
  Top 0.305: JP3.1 44.85,55.55 v48.4,52 49.55,52 R34.2 | v48.4,47.4 48.4,48.83 TS5A23166_1.1
  Bottom 0.305: v48.4,52 v48.4,47.4
SW_CTRL_2
  Top 0.305: TS5A23166_1.5 45.6,50.55 R35.2 43.5,53.02 JP3.2
SW_CTRL_3  (via drill 0.35)
  Top 0.305: JP3.3 38.43,55.27 R36.2 38.85,52.65 v38.8,52.6 | v38.8,47.6 38.8,49.23 TS5A23166_2.1
  Bottom 0.305: v38.8,52.6 v38.8,47.6
SW_CTRL_4
  Top 0.305: TS5A23166_2.5 34.08,52.65 R37.2 33.4,53.06 JP3.4
SW_CTRL_PWR  (via drill 0.35)
  Top 0.2: 66.36,55.36 v66.4,55.4
  Top 0.305: TS5A4624.1 26.45,44.55 v30.8,40.2 | JP1.2 66.25,55.25 66.36,55.36 66.6,55.12 66.6,49 67.35,48.25 R38.2
  Bottom 0.254: v30.8,40.2 31,40.2
  Bottom 0.305: 31,40.2 34.2,37 68.2,37 71.5,40.3 71.5,53.1 69.2,55.4 v66.4,55.4
V_CALIB
  Top 0.254: 59.8,43 59.83,43 | 63.08,43 TS5A3159.3 | 46.48,49.6 46.43,49.55 | 48.51,41.8 48.4,41.8
  Top 0.305: TS5A23166_2.3 37.6,50.25 37.6,49.72 | TS5A23166_1.3 47.25,50.05 47,49.8 | 47,49.8 46.8,49.6 46.48,49.6 | 46.43,49.55 TS5A23166_1.7 | 47,49.8 47,43.2 48.4,41.8 | 59.83,43 58.63,41.8 48.51,41.8 39.2,41.8 37.6,43.4 37.6,49.72 | TS5A3159.3 59.93,43.1 59.83,43 | 59.83,43 59.83,45.43 61,46.6 61,48.3 VCALIB_LED.A | TS5A23166_2.7 37.57,49.75 37.6,49.72
V_EXT
  Top 0.305: JP6.3 6.38,53.82 7,53.2 15.05,53.2 17.06,51.19 17.06,46.19 18.72,44.52 20.5,44.52 TS5A4624.6 20.52,42.65 20.34,42.48 20.34,40.25 VMCU_EXT_LED.A
VIN
  Top 0.254: 22.2,43.6 21.73,44.07 21.54,44.26 21.54,44.87 21.21,45.2 TS5A4624.5
  Top 0.305: TP7.TP 29.8,9.18 U$1.E1 30.2,15.89 30.2,20.4 26.6,24 26.6,42.6 25.6,43.6 22.2,43.6
VMCU
  Top 0.305: X1.1 30.54,52.94 35.4,57.8 49.8,57.8 51.4,56.2 51.4,55.48 JP5.1 57.55,55.45 63.6,49.4 63.6,48.4 63,47.8 VMCU_LED.A 62.25,45.93 TS5A3159.1
VOUT
  Top 0.305: TP8.TP 33.4,9.8 35.4,11.8 35.4,14.12 U$1.E2 32,17.52 32,21.4 28.2,25.2 28.2,36.6 30,38.4 62.6,38.4 65.52,41.32 TS5A3159.4

### Text on the board
tNames: GND | VEXT | GND | 5V | SW | SW4 | SW3 | SW2 | SW1 | GND | VMCU | SW0 | PWR | 5V_R | 5V | 5V_F | ALT | SDA | SCL | ADC | 5V_F | 5.5V | 5V_R | VIN | VOUT | SHUNT+ | SHUNT- | S1_OUT | S1_OUT_F | S2_OUT
bDocu: Current Measurement Board | V0.2 ltc6102